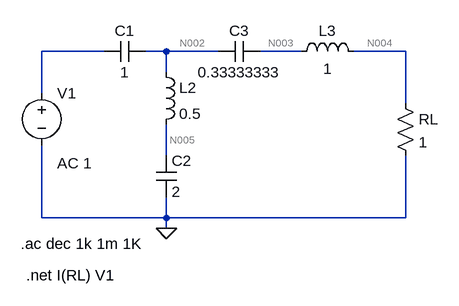
[diagram p0: schematic EJ_1D.asc]
EJ_1D.asc, the LTspice schematic file:
Version 4
SHEET 1 880 680
WIRE 112 128 16 128
WIRE 208 128 176 128
WIRE 288 128 208 128
WIRE 416 128 352 128
WIRE 576 128 496 128
WIRE 208 160 208 128
WIRE 16 192 16 128
WIRE 576 208 576 128
WIRE 208 288 208 240
WIRE 16 384 16 272
WIRE 208 384 208 352
WIRE 208 384 16 384
WIRE 576 384 576 288
WIRE 576 384 208 384
WIRE 208 400 208 384
FLAG 208 400 0
SYMBOL cap 176 112 R90
WINDOW 0 0 32 VBottom 2
WINDOW 3 32 32 VTop 2
SYMATTR InstName C1
SYMATTR Value 1
SYMBOL ind 192 144 R0
SYMATTR InstName L2
SYMATTR Value 0.5
SYMBOL cap 192 288 R0
SYMATTR InstName C2
SYMATTR Value 2
SYMBOL cap 352 112 R90
WINDOW 0 0 32 VBottom 2
WINDOW 3 32 32 VTop 2
SYMATTR InstName C3
SYMATTR Value 0.33333333
SYMBOL ind 400 144 R270
WINDOW 0 32 56 VTop 2
WINDOW 3 5 56 VBottom 2
SYMATTR InstName L3
SYMATTR Value 1
SYMBOL voltage 16 176 R0
WINDOW 123 24 124 Left 2
WINDOW 39 0 0 Left 0
SYMATTR Value2 AC 1
SYMATTR InstName V1
SYMATTR Value ""
SYMBOL res 560 192 R0
SYMATTR InstName RL
SYMATTR Value 1
TEXT -16 424 Left 2 !.ac dec 1k 1m 1K
TEXT -8 472 Left 2 !.net I(RL) V1

The netlist it stands for:
* EJ_1D.asc
C1 N002 N001 1
L2 N002 N005 0.5
C2 N005 0 2
C3 N003 N002 0.33333333
L3 N003 N004 1
V1 N001 0 AC 1
RL N004 0 1
.ac dec 1k 1m 1K
.net I(RL) V1
.backanno
.end

* Results of the author's LTspice run, read from the files saved beside the schematic
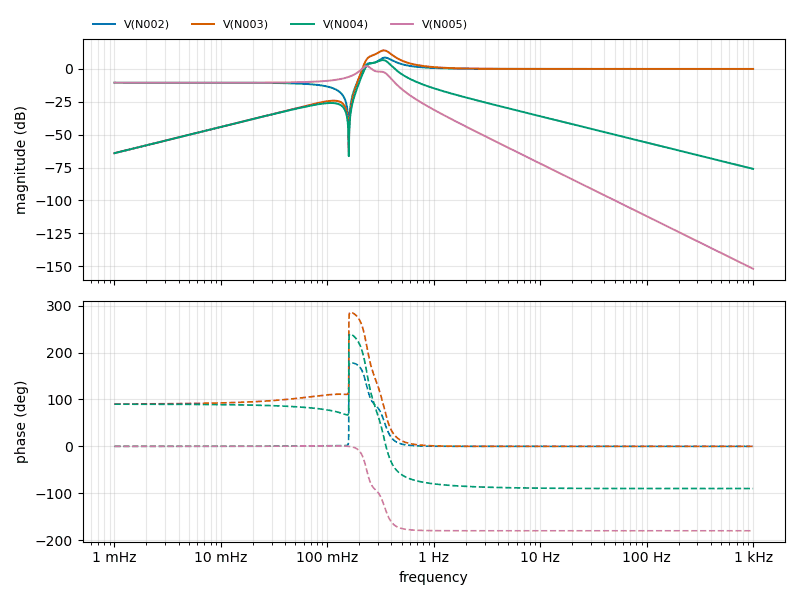
[diagram p1: AC Analysis of EJ_1D.asc, plotted from the saved traces]
* AC Analysis, 1 run:
*   V(N002): -10.46 dB at 1 mHz, 0.00 dB at 1 kHz, peak 8.63 dB at 348.3 mHz, 3 dB below the peak at 293 mHz and 428.7 mHz
*   V(N003): -64.03 dB at 1 mHz, 0.00 dB at 1 kHz, peak 14.13 dB at 339.6 mHz, 3 dB below the peak at 281.7 mHz and 399.4 mHz
*   V(N004): -64.04 dB at 1 mHz, -75.96 dB at 1 kHz, peak 6.75 dB at 332.7 mHz, 3 dB below the peak at 245.9 mHz and 384.7 mHz
*   V(N005): -10.46 dB at 1 mHz, -151.93 dB at 1 kHz, peak 2.15 dB at 234.4 mHz, 3 dB below the peak at 205.5 mHz and 270 mHz